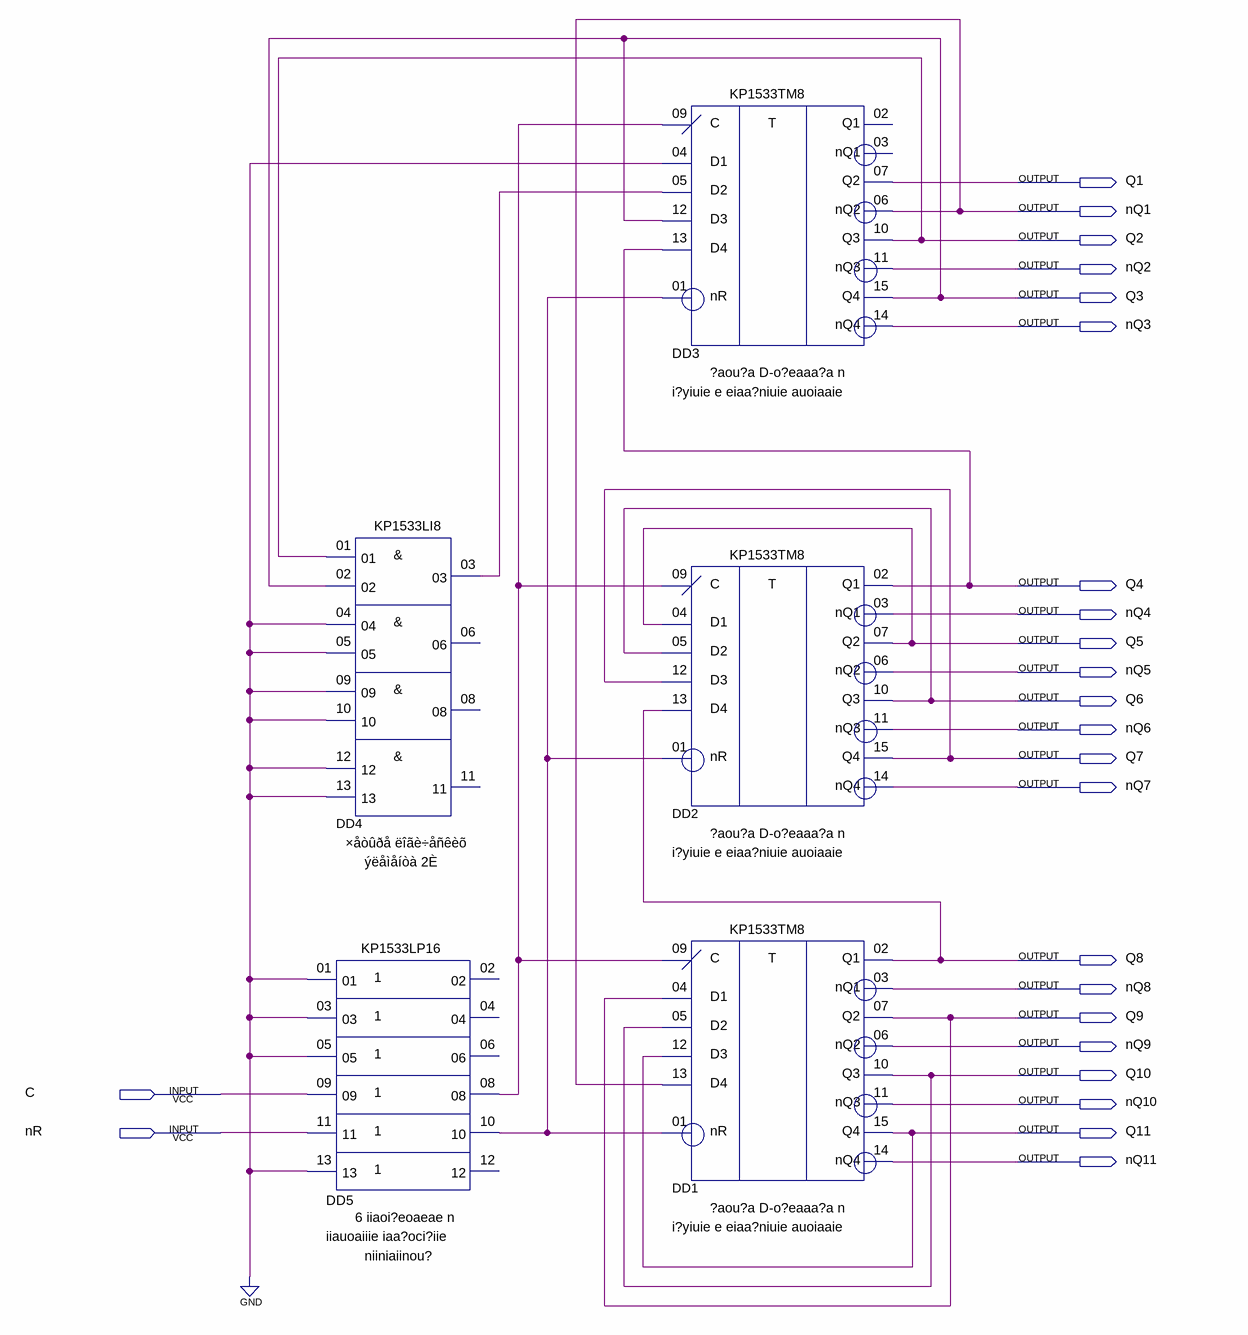
[diagram p0: schematic sheet]
// Quartus schematic JohnsonCounterDFF.bdf as structural Verilog: 5 symbols, 24 pins
module JohnsonCounterDFF (
  input  C,
  input  nR,
  output Q1,
  output nQ1,
  output Q2,
  output nQ2,
  output Q3,
  output nQ3,
  output Q4,
  output nQ4,
  output Q5,
  output nQ5,
  output Q6,
  output nQ6,
  output Q7,
  output nQ7,
  output Q8,
  output nQ8,
  output Q9,
  output nQ9,
  output Q10,
  output nQ10,
  output Q11,
  output nQ11
);

  wire DD4_03, DD5_08, DD5_10;

  KP1533LI8 DD4 (
    .\01 (Q2), .\02 (Q3), .\04 (1'b0), .\05 (1'b0), .\09 (1'b0), .\10 (1'b0), .\12 (1'b0), .\13 (1'b0),
    .\03 (DD4_03));  // open: 06, 08, 11
  KP1533LP16 DD5 (
    .\01 (1'b0), .\03 (1'b0), .\05 (1'b0), .\09 (C), .\11 (nR), .\13 (1'b0), .\08 (DD5_08), .\10 (DD5_10));  // open: 02, 04, 06, 12
  KP1533TM8 DD3 (
    .nR(DD5_10), .C(DD5_08), .D1(1'b0), .D2(DD4_03), .D3(Q3), .D4(Q4), .Q2(Q1), .nQ2(nQ1), .Q3(Q2),
    .nQ3(nQ2), .Q4(Q3), .nQ4(nQ3));  // open: Q1, nQ1
  KP1533TM8 DD2 (
    .nR(DD5_10), .C(DD5_08), .D1(Q5), .D2(Q6), .D3(Q7), .D4(Q8), .Q1(Q4), .nQ1(nQ4), .Q2(Q5), .nQ2(nQ5),
    .Q3(Q6), .nQ3(nQ6), .Q4(Q7), .nQ4(nQ7));
  KP1533TM8 DD1 (
    .nR(DD5_10), .C(DD5_08), .D1(Q9), .D2(Q10), .D3(Q11), .D4(nQ1), .Q1(Q8), .nQ1(nQ8), .Q2(Q9), .nQ2(nQ9),
    .Q3(Q10), .nQ3(nQ10), .Q4(Q11), .nQ4(nQ11));
endmodule
